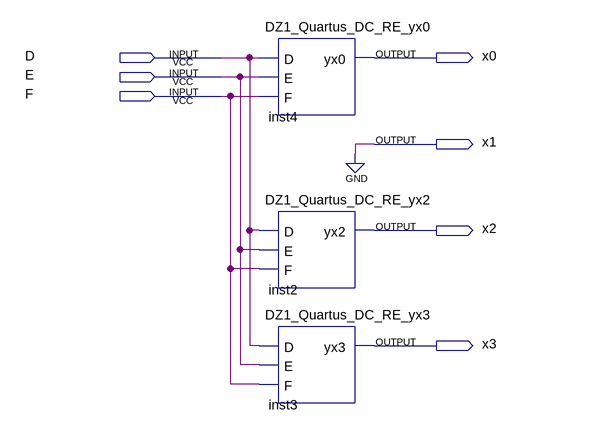
[diagram p0: schematic sheet]
// Quartus schematic DC_Reverse.bdf as structural Verilog: 3 symbols, 7 pins
module DC_Reverse (
  input  D,
  input  E,
  input  F,
  output x0,
  output x1,
  output x2,
  output x3
);

  DZ1_Quartus_DC_RE_yx0 inst4 (.D(D), .E(E), .F(F), .yx0(x0));
  DZ1_Quartus_DC_RE_yx2 inst2 (.D(D), .E(E), .F(F), .yx2(x2));
  DZ1_Quartus_DC_RE_yx3 inst3 (.D(D), .E(E), .F(F), .yx3(x3));

  assign x1 = 1'b0;
endmodule
